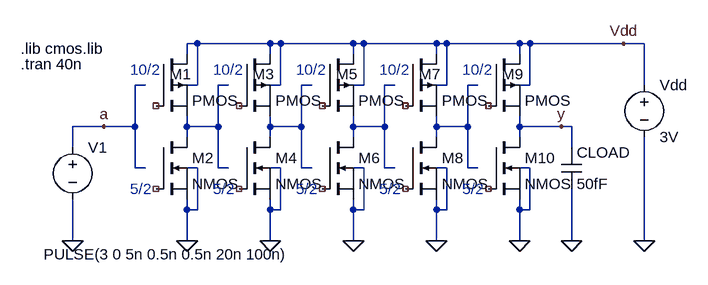
[diagram p0: schematic inv_switching_v2.asc]
inv_switching_v2.asc, the LTspice schematic file:
Version 4
SHEET 1 1292 680
WIRE -800 -48 -816 -48
WIRE -688 -48 -800 -48
WIRE -672 -48 -688 -48
WIRE -560 -48 -672 -48
WIRE -544 -48 -560 -48
WIRE -432 -48 -544 -48
WIRE -416 -48 -432 -48
WIRE -304 -48 -416 -48
WIRE -288 -48 -304 -48
WIRE -144 -48 -288 -48
WIRE -112 -48 -144 -48
WIRE -816 -32 -816 -48
WIRE -688 -32 -688 -48
WIRE -560 -32 -560 -48
WIRE -432 -32 -432 -48
WIRE -304 -32 -304 -48
WIRE -880 16 -896 16
WIRE -800 16 -800 -48
WIRE -800 16 -816 16
WIRE -752 16 -768 16
WIRE -672 16 -672 -48
WIRE -672 16 -688 16
WIRE -624 16 -640 16
WIRE -544 16 -544 -48
WIRE -544 16 -560 16
WIRE -496 16 -512 16
WIRE -416 16 -416 -48
WIRE -416 16 -432 16
WIRE -368 16 -384 16
WIRE -288 16 -288 -48
WIRE -288 16 -304 16
WIRE -112 16 -112 -48
WIRE -944 80 -992 80
WIRE -896 80 -896 16
WIRE -896 80 -944 80
WIRE -816 80 -816 64
WIRE -768 80 -768 16
WIRE -768 80 -816 80
WIRE -688 80 -688 64
WIRE -640 80 -640 16
WIRE -640 80 -688 80
WIRE -560 80 -560 64
WIRE -512 80 -512 16
WIRE -512 80 -560 80
WIRE -432 80 -432 64
WIRE -384 80 -384 16
WIRE -384 80 -432 80
WIRE -304 80 -304 64
WIRE -240 80 -304 80
WIRE -224 80 -240 80
WIRE -816 96 -816 80
WIRE -688 96 -688 80
WIRE -560 96 -560 80
WIRE -432 96 -432 80
WIRE -304 96 -304 80
WIRE -992 112 -992 80
WIRE -224 112 -224 80
WIRE -896 144 -896 80
WIRE -880 144 -896 144
WIRE -800 144 -816 144
WIRE -768 144 -768 80
WIRE -752 144 -768 144
WIRE -672 144 -688 144
WIRE -640 144 -640 80
WIRE -624 144 -640 144
WIRE -544 144 -560 144
WIRE -512 144 -512 80
WIRE -496 144 -512 144
WIRE -416 144 -432 144
WIRE -384 144 -384 80
WIRE -368 144 -384 144
WIRE -288 144 -304 144
WIRE -816 208 -816 192
WIRE -800 208 -800 144
WIRE -800 208 -816 208
WIRE -688 208 -688 192
WIRE -672 208 -672 144
WIRE -672 208 -688 208
WIRE -560 208 -560 192
WIRE -544 208 -544 144
WIRE -544 208 -560 208
WIRE -432 208 -432 192
WIRE -416 208 -416 144
WIRE -416 208 -432 208
WIRE -304 208 -304 192
WIRE -288 208 -288 144
WIRE -288 208 -304 208
WIRE -992 256 -992 192
WIRE -816 256 -816 208
WIRE -688 256 -688 208
WIRE -560 256 -560 208
WIRE -432 256 -432 208
WIRE -304 256 -304 208
WIRE -224 256 -224 176
WIRE -112 256 -112 96
FLAG -816 256 0
FLAG -112 256 0
FLAG -992 256 0
FLAG -224 256 0
FLAG -240 80 y
FLAG -944 80 a
FLAG -144 -48 Vdd
FLAG -688 256 0
FLAG -560 256 0
FLAG -432 256 0
FLAG -304 256 0
SYMBOL voltage -112 0 R0
WINDOW 123 0 0 Left 2
WINDOW 39 0 0 Left 2
SYMATTR InstName Vdd
SYMATTR Value 3V
SYMBOL voltage -992 96 R0
WINDOW 123 0 0 Left 2
WINDOW 39 0 0 Left 2
WINDOW 3 -45 181 Left 2
SYMATTR Value PULSE(3 0 5n 0.5n 0.5n 20n 100n)
SYMATTR InstName V1
SYMBOL cap -240 112 R0
SYMATTR InstName CLOAD
SYMATTR Value 50fF
SYMBOL pmos -864 -32 R0
WINDOW 0 21 31 Left 2
SYMATTR InstName M1
SYMATTR Value2 l=0.6u w=3u
SYMATTR SpiceModel ""
SYMATTR Value PMOS
SYMBOL nmos -864 96 R0
SYMATTR InstName M2
SYMATTR Value NMOS
SYMATTR Value2 l=0.6u w=1.5u
SYMBOL pmos -736 -32 R0
WINDOW 0 21 31 Left 2
SYMATTR InstName M3
SYMATTR Value2 l=0.6u w=3u
SYMATTR SpiceModel ""
SYMATTR Value PMOS
SYMBOL nmos -736 96 R0
SYMATTR InstName M4
SYMATTR Value NMOS
SYMATTR Value2 l=0.6u w=1.5u
SYMBOL pmos -608 -32 R0
WINDOW 0 21 31 Left 2
SYMATTR InstName M5
SYMATTR Value2 l=0.6u w=3u
SYMATTR SpiceModel ""
SYMATTR Value PMOS
SYMBOL nmos -608 96 R0
SYMATTR InstName M6
SYMATTR Value NMOS
SYMATTR Value2 l=0.6u w=1.5u
SYMBOL pmos -480 -32 R0
WINDOW 0 21 31 Left 2
SYMATTR InstName M7
SYMATTR Value2 l=0.6u w=3u
SYMATTR SpiceModel ""
SYMATTR Value PMOS
SYMBOL nmos -480 96 R0
SYMATTR InstName M8
SYMATTR Value NMOS
SYMATTR Value2 l=0.6u w=1.5u
SYMBOL pmos -352 -32 R0
WINDOW 0 21 31 Left 2
SYMATTR InstName M9
SYMATTR Value2 l=0.6u w=3u
SYMATTR SpiceModel ""
SYMATTR Value PMOS
SYMBOL nmos -352 96 R0
SYMATTR InstName M10
SYMATTR Value NMOS
SYMATTR Value2 l=0.6u w=1.5u
TEXT -1072 -16 Left 2 !.tran 40n
TEXT -1072 -40 Left 2 !.lib cmos.lib
TEXT -904 -8 Left 2 ;10/2
TEXT -904 176 Left 2 ;5/2
TEXT -776 -8 Left 2 ;10/2
TEXT -776 176 Left 2 ;5/2
TEXT -648 -8 Left 2 ;10/2
TEXT -648 176 Left 2 ;5/2
TEXT -520 -8 Left 2 ;10/2
TEXT -520 176 Left 2 ;5/2
TEXT -392 -8 Left 2 ;10/2
TEXT -392 176 Left 2 ;5/2

The netlist it stands for:
* inv_switching_v2.asc
Vdd Vdd 0 3V
V1 a 0 PULSE(3 0 5n 0.5n 0.5n 20n 100n)
CLOAD y 0 50fF
* M1: PMOS l=0.6u w=3u (symbol pmos not certain, pin order unknown); nets seen at it: N001, Vdd
* M2: NMOS l=0.6u w=1.5u (symbol nmos not certain, pin order unknown); nets seen at it: 0, N001
* M3: PMOS l=0.6u w=3u (symbol pmos not certain, pin order unknown); nets seen at it: N002, Vdd
* M4: NMOS l=0.6u w=1.5u (symbol nmos not certain, pin order unknown); nets seen at it: 0, N002
* M5: PMOS l=0.6u w=3u (symbol pmos not certain, pin order unknown); nets seen at it: N003, Vdd
* M6: NMOS l=0.6u w=1.5u (symbol nmos not certain, pin order unknown); nets seen at it: 0, N003
* M7: PMOS l=0.6u w=3u (symbol pmos not certain, pin order unknown); nets seen at it: N004, Vdd
* M8: NMOS l=0.6u w=1.5u (symbol nmos not certain, pin order unknown); nets seen at it: 0, N004
* M9: PMOS l=0.6u w=3u (symbol pmos not certain, pin order unknown); nets seen at it: Vdd, y
* M10: NMOS l=0.6u w=1.5u (symbol nmos not certain, pin order unknown); nets seen at it: 0, y
.tran 40n
.lib cmos.lib
* 10/2
* 5/2
* 10/2
* 5/2
* 10/2
* 5/2
* 10/2
* 5/2
* 10/2
* 5/2
.backanno
.end